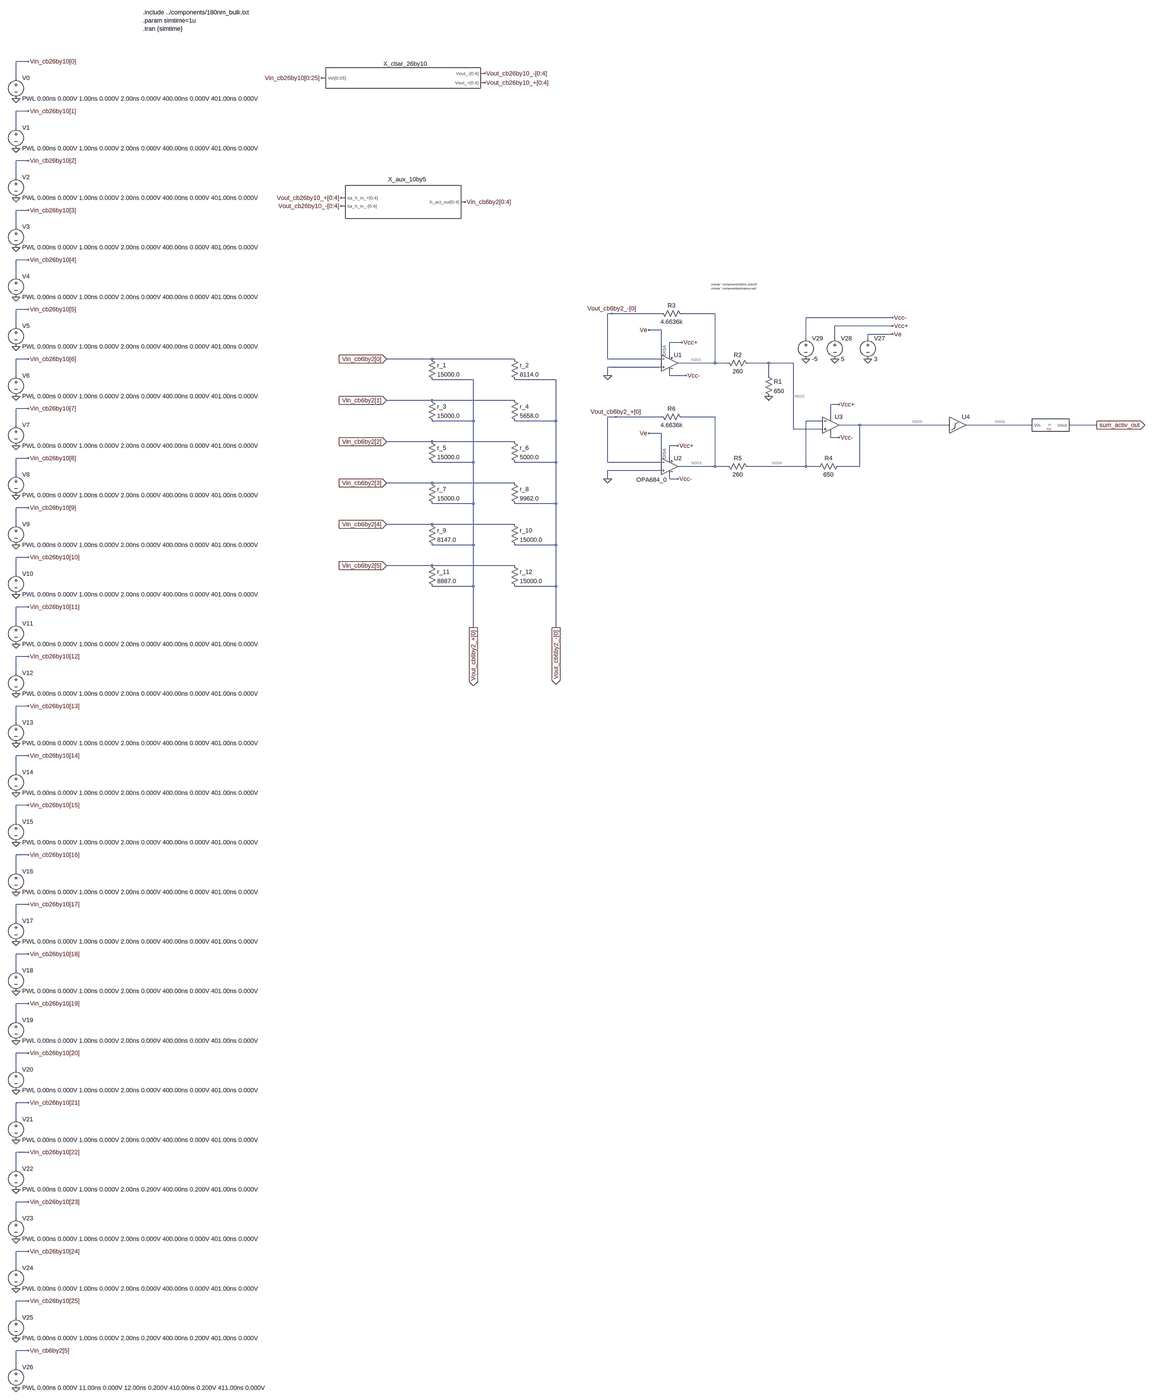
[diagram p0: schematic complete_circuit_generated_2.asc, whole sheet]
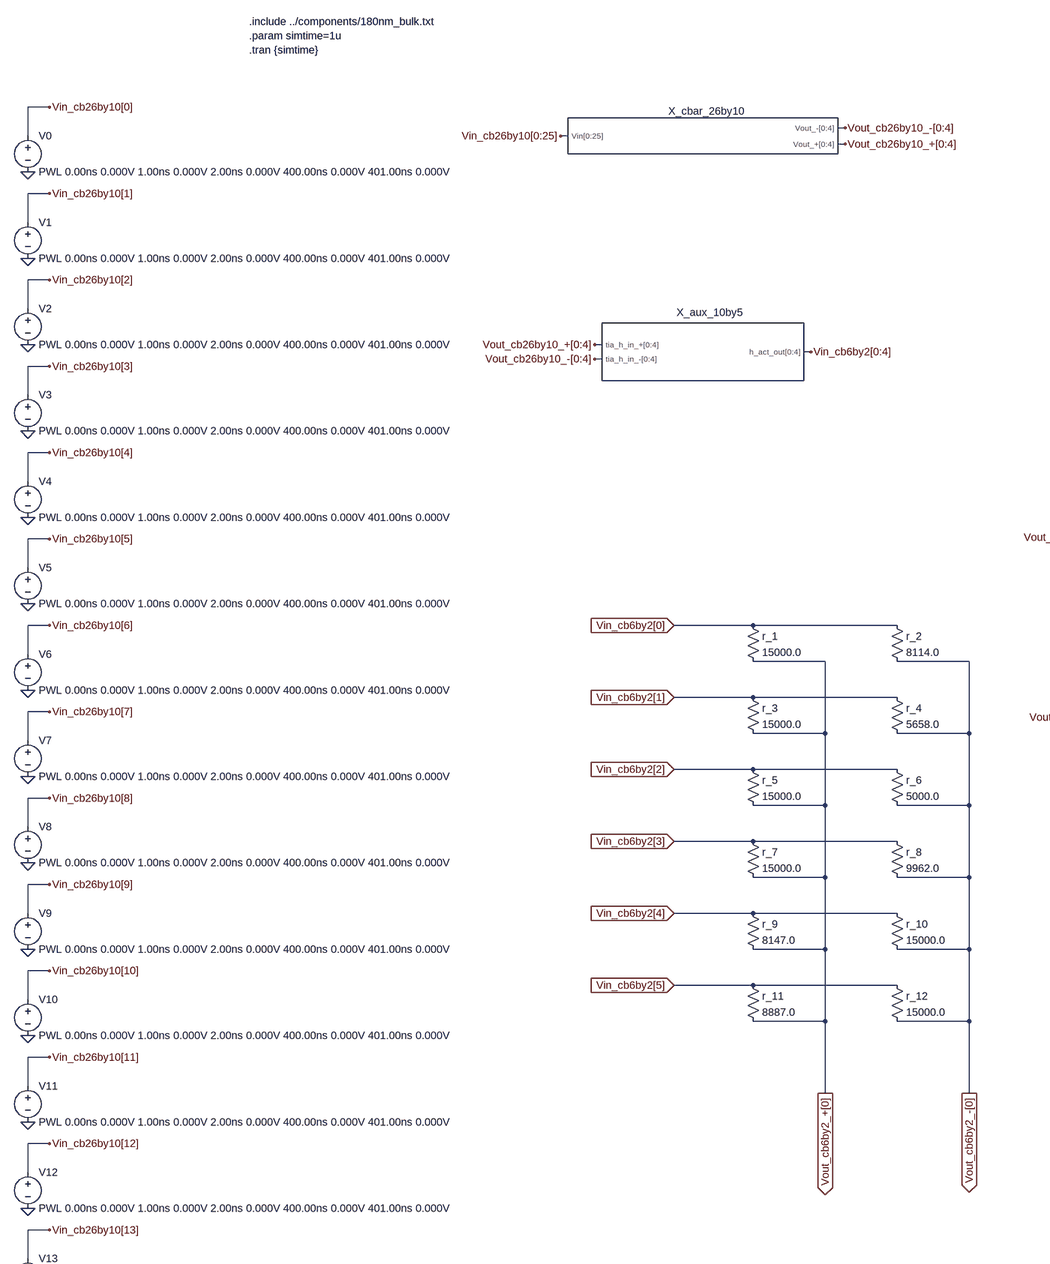
[diagram p1: schematic complete_circuit_generated_2.asc, part, row 1 of 2, column 1 of 2]
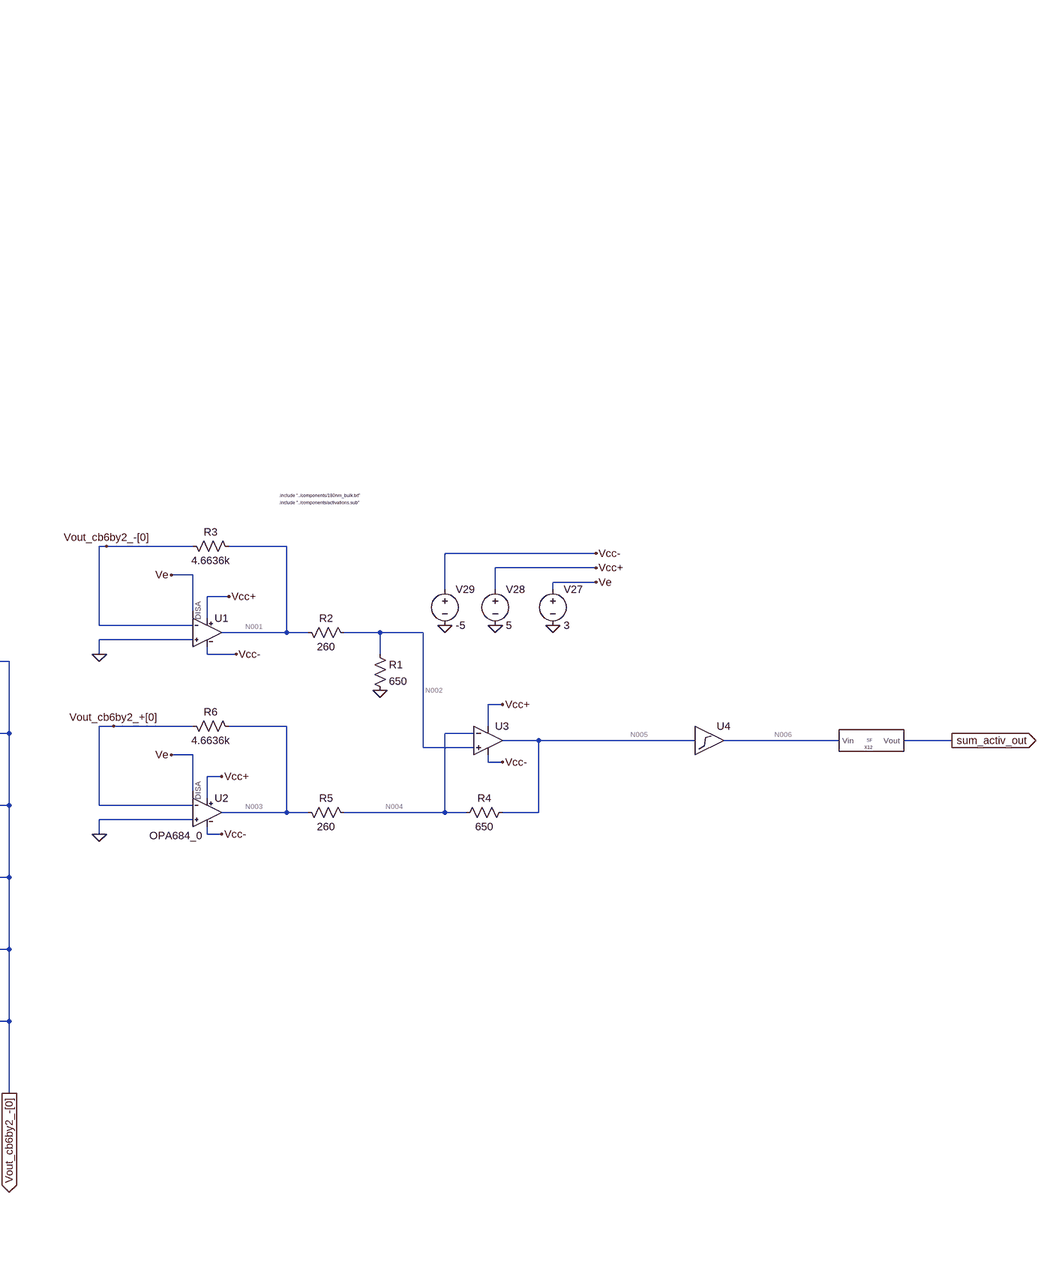
[diagram p2: schematic complete_circuit_generated_2.asc, part, row 1 of 2, column 2 of 2]
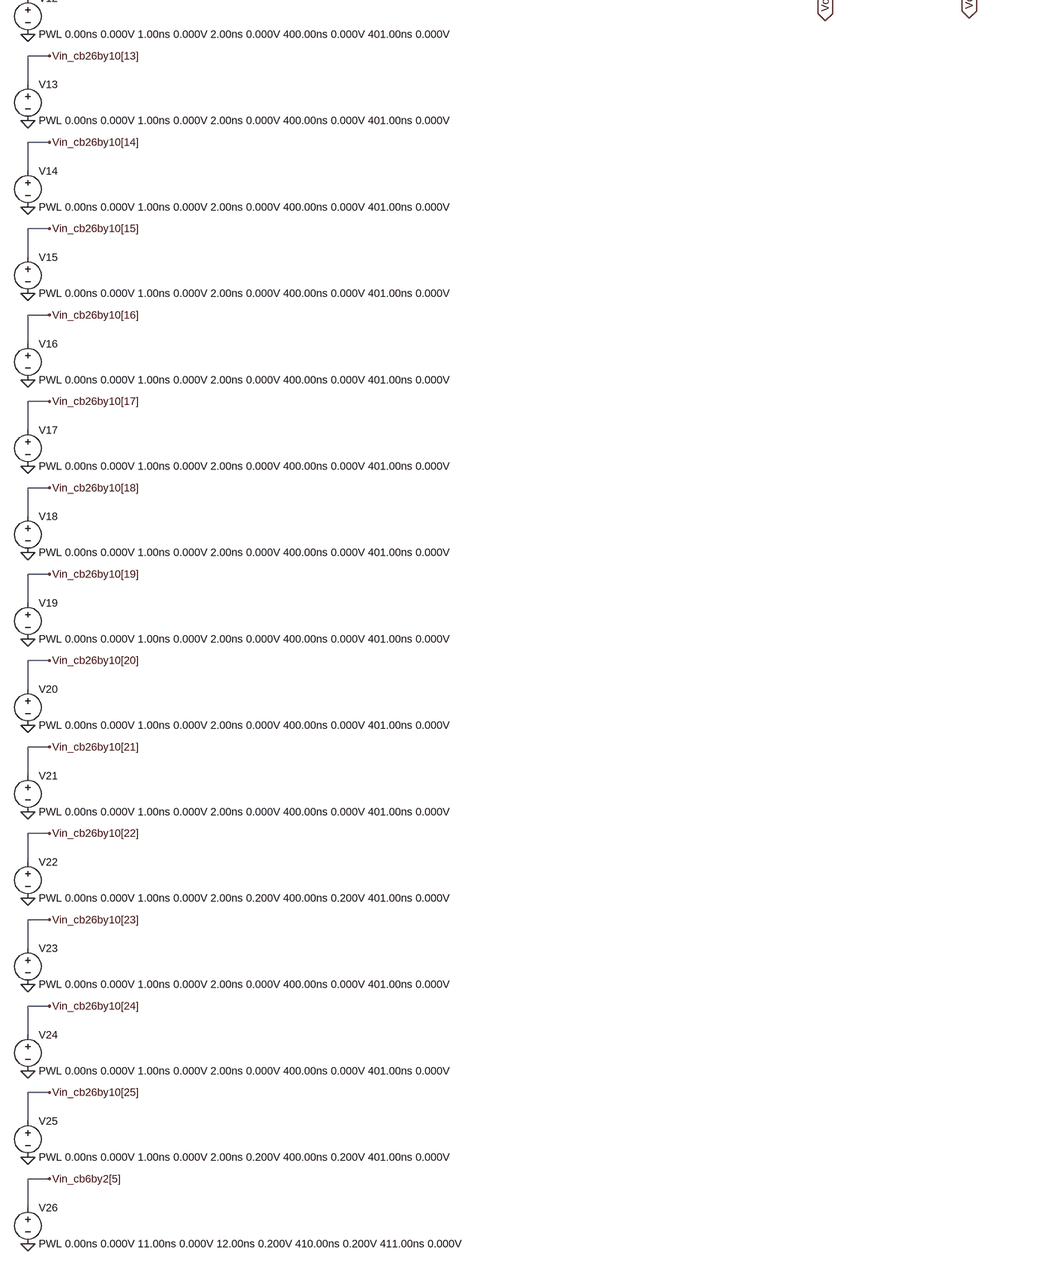
[diagram p3: schematic complete_circuit_generated_2.asc, part, row 2 of 2, column 1 of 2]
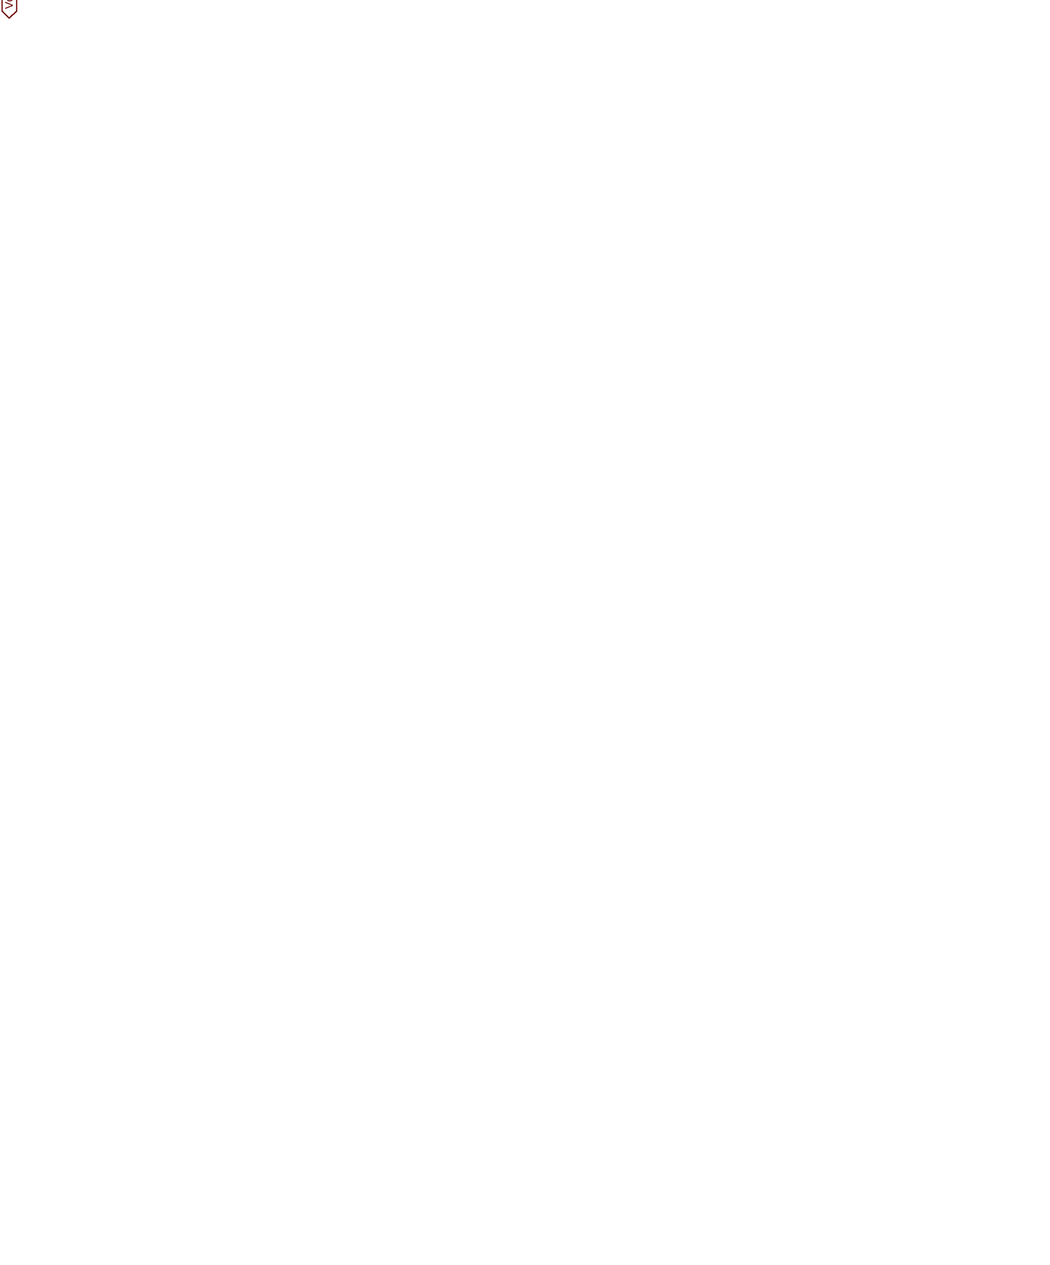
[diagram p4: schematic complete_circuit_generated_2.asc, part, row 2 of 2, column 2 of 2]
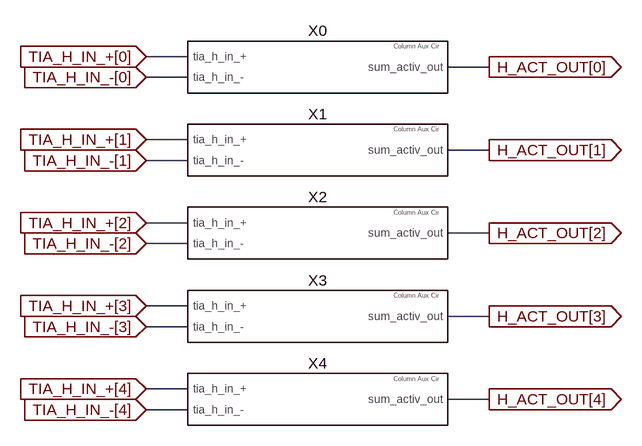
[diagram p5: sub-circuit x_aux_10by5.asc]
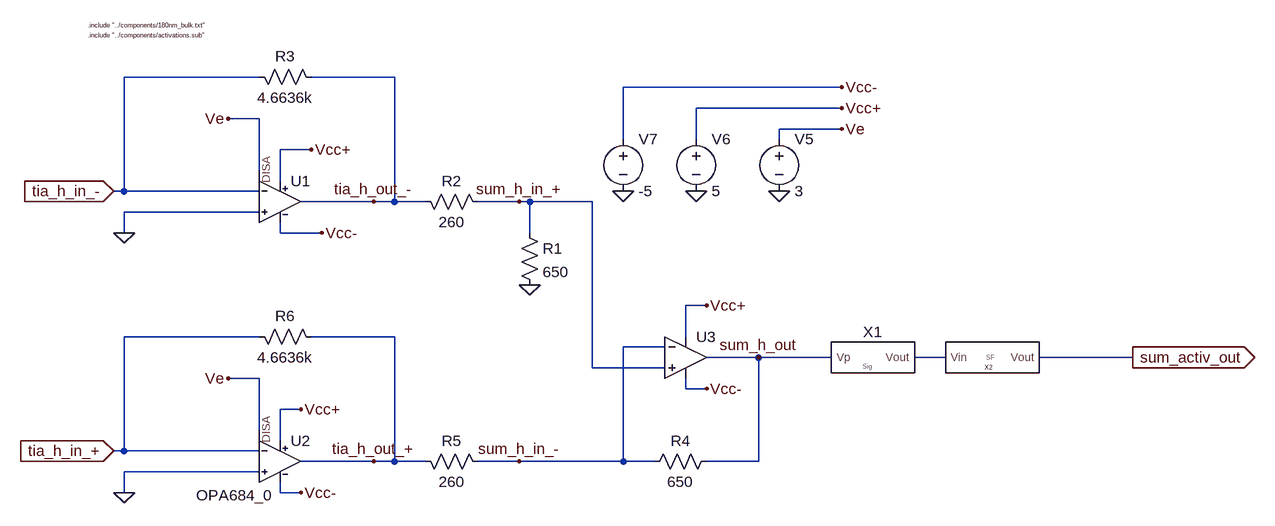
[diagram p6: sub-circuit column_activ_cmos.asc]
* complete_circuit_generated_2.asc
XX_cbar_26by10 Vin_cb26by10[0] Vin_cb26by10[1] Vin_cb26by10[2] Vin_cb26by10[3] Vin_cb26by10[4] Vin_cb26by10[5] Vin_cb26by10[6] Vin_cb26by10[7] Vin_cb26by10[8] Vin_cb26by10[9] Vin_cb26by10[10] Vin_cb26by10[11] Vin_cb26by10[12] Vin_cb26by10[13] Vin_cb26by10[14] Vin_cb26by10[15] Vin_cb26by10[16] Vin_cb26by10[17] Vin_cb26by10[18] Vin_cb26by10[19] Vin_cb26by10[20] Vin_cb26by10[21] Vin_cb26by10[22] Vin_cb26by10[23] Vin_cb26by10[24] Vin_cb26by10[25] Vout_cb26by10_+[0] Vout_cb26by10_+[1] Vout_cb26by10_+[2] Vout_cb26by10_+[3] Vout_cb26by10_+[4] Vout_cb26by10_-[0] Vout_cb26by10_-[1] Vout_cb26by10_-[2] Vout_cb26by10_-[3] Vout_cb26by10_-[4] X_cbar_26by10  ; pins Vin[0:25] Vout_+[0:4] Vout_-[0:4]
XX_aux_10by5 Vout_cb26by10_+[0] Vout_cb26by10_+[1] Vout_cb26by10_+[2] Vout_cb26by10_+[3] Vout_cb26by10_+[4] Vout_cb26by10_-[0] Vout_cb26by10_-[1] Vout_cb26by10_-[2] Vout_cb26by10_-[3] Vout_cb26by10_-[4] Vin_cb6by2[0] Vin_cb6by2[1] Vin_cb6by2[2] Vin_cb6by2[3] Vin_cb6by2[4] x_aux_10by5
V0 Vin_cb26by10[0] 0 PWL 0.00ns 0.000V 1.00ns 0.000V 2.00ns 0.000V 400.00ns 0.000V 401.00ns 0.000V
V1 Vin_cb26by10[1] 0 PWL 0.00ns 0.000V 1.00ns 0.000V 2.00ns 0.000V 400.00ns 0.000V 401.00ns 0.000V
V2 Vin_cb26by10[2] 0 PWL 0.00ns 0.000V 1.00ns 0.000V 2.00ns 0.000V 400.00ns 0.000V 401.00ns 0.000V
V3 Vin_cb26by10[3] 0 PWL 0.00ns 0.000V 1.00ns 0.000V 2.00ns 0.000V 400.00ns 0.000V 401.00ns 0.000V
V4 Vin_cb26by10[4] 0 PWL 0.00ns 0.000V 1.00ns 0.000V 2.00ns 0.000V 400.00ns 0.000V 401.00ns 0.000V
V5 Vin_cb26by10[5] 0 PWL 0.00ns 0.000V 1.00ns 0.000V 2.00ns 0.000V 400.00ns 0.000V 401.00ns 0.000V
V6 Vin_cb26by10[6] 0 PWL 0.00ns 0.000V 1.00ns 0.000V 2.00ns 0.000V 400.00ns 0.000V 401.00ns 0.000V
V7 Vin_cb26by10[7] 0 PWL 0.00ns 0.000V 1.00ns 0.000V 2.00ns 0.000V 400.00ns 0.000V 401.00ns 0.000V
V8 Vin_cb26by10[8] 0 PWL 0.00ns 0.000V 1.00ns 0.000V 2.00ns 0.000V 400.00ns 0.000V 401.00ns 0.000V
V9 Vin_cb26by10[9] 0 PWL 0.00ns 0.000V 1.00ns 0.000V 2.00ns 0.000V 400.00ns 0.000V 401.00ns 0.000V
V10 Vin_cb26by10[10] 0 PWL 0.00ns 0.000V 1.00ns 0.000V 2.00ns 0.000V 400.00ns 0.000V 401.00ns 0.000V
V11 Vin_cb26by10[11] 0 PWL 0.00ns 0.000V 1.00ns 0.000V 2.00ns 0.000V 400.00ns 0.000V 401.00ns 0.000V
V12 Vin_cb26by10[12] 0 PWL 0.00ns 0.000V 1.00ns 0.000V 2.00ns 0.000V 400.00ns 0.000V 401.00ns 0.000V
V13 Vin_cb26by10[13] 0 PWL 0.00ns 0.000V 1.00ns 0.000V 2.00ns 0.000V 400.00ns 0.000V 401.00ns 0.000V
V14 Vin_cb26by10[14] 0 PWL 0.00ns 0.000V 1.00ns 0.000V 2.00ns 0.000V 400.00ns 0.000V 401.00ns 0.000V
V15 Vin_cb26by10[15] 0 PWL 0.00ns 0.000V 1.00ns 0.000V 2.00ns 0.000V 400.00ns 0.000V 401.00ns 0.000V
V16 Vin_cb26by10[16] 0 PWL 0.00ns 0.000V 1.00ns 0.000V 2.00ns 0.000V 400.00ns 0.000V 401.00ns 0.000V
V17 Vin_cb26by10[17] 0 PWL 0.00ns 0.000V 1.00ns 0.000V 2.00ns 0.000V 400.00ns 0.000V 401.00ns 0.000V
V18 Vin_cb26by10[18] 0 PWL 0.00ns 0.000V 1.00ns 0.000V 2.00ns 0.000V 400.00ns 0.000V 401.00ns 0.000V
V19 Vin_cb26by10[19] 0 PWL 0.00ns 0.000V 1.00ns 0.000V 2.00ns 0.000V 400.00ns 0.000V 401.00ns 0.000V
V20 Vin_cb26by10[20] 0 PWL 0.00ns 0.000V 1.00ns 0.000V 2.00ns 0.000V 400.00ns 0.000V 401.00ns 0.000V
V21 Vin_cb26by10[21] 0 PWL 0.00ns 0.000V 1.00ns 0.000V 2.00ns 0.000V 400.00ns 0.000V 401.00ns 0.000V
V22 Vin_cb26by10[22] 0 PWL 0.00ns 0.000V 1.00ns 0.000V 2.00ns 0.200V 400.00ns 0.200V 401.00ns 0.000V
V23 Vin_cb26by10[23] 0 PWL 0.00ns 0.000V 1.00ns 0.000V 2.00ns 0.000V 400.00ns 0.000V 401.00ns 0.000V
V24 Vin_cb26by10[24] 0 PWL 0.00ns 0.000V 1.00ns 0.000V 2.00ns 0.000V 400.00ns 0.000V 401.00ns 0.000V
V25 Vin_cb26by10[25] 0 PWL 0.00ns 0.000V 1.00ns 0.000V 2.00ns 0.200V 400.00ns 0.200V 401.00ns 0.000V
V26 Vin_cb6by2[5] 0 PWL 0.00ns 0.000V 11.00ns 0.000V 12.00ns 0.200V 410.00ns 0.200V 411.00ns 0.000V
R1 N002 0 650
R2 N002 N001 260
R3 N001 Vout_cb6by2_-[0] 4.6636k
XU1 0 Vout_cb6by2_-[0] Vcc+ Vcc- N001 Ve OPA684_0  ; pins In+ In- V+ V- OUT DISA
V27 Ve 0 3
V28 Vcc+ 0 5
V29 Vcc- 0 -5
R4 N005 N004 650
R5 N004 N003 260
R6 N003 Vout_cb6by2_+[0] 4.6636k
XU2 0 Vout_cb6by2_+[0] Vcc+ Vcc- N003 Ve OPA684_0  ; pins In+ In- V+ V- OUT DISA
XU3 N002 N004 Vcc+ Vcc- N005 MAX4223  ; pins In+ In- V+ V- OUT
XX12 N006 sum_activ_out sourceFollower  ; pins Vin Vout
r_1 Vin_cb6by2[0] Vout_cb6by2_+[0] 15000.0
r_2 Vin_cb6by2[0] Vout_cb6by2_-[0] 8114.0
r_3 Vin_cb6by2[1] Vout_cb6by2_+[0] 15000.0
r_4 Vin_cb6by2[1] Vout_cb6by2_-[0] 5658.0
r_5 Vin_cb6by2[2] Vout_cb6by2_+[0] 15000.0
r_6 Vin_cb6by2[2] Vout_cb6by2_-[0] 5000.0
r_7 Vin_cb6by2[3] Vout_cb6by2_+[0] 15000.0
r_8 Vin_cb6by2[3] Vout_cb6by2_-[0] 9962.0
r_9 Vin_cb6by2[4] Vout_cb6by2_+[0] 8147.0
r_10 Vin_cb6by2[4] Vout_cb6by2_-[0] 15000.0
r_11 Vin_cb6by2[5] Vout_cb6by2_+[0] 8887.0
r_12 Vin_cb6by2[5] Vout_cb6by2_-[0] 15000.0
XU4 N005 N006 ReLU  ; pins In OUT

* block symbol definitions
.subckt x_aux_10by5 tia_h_in_+[0] tia_h_in_+[1] tia_h_in_+[2] tia_h_in_+[3] tia_h_in_+[4] tia_h_in_-[0] tia_h_in_-[1] tia_h_in_-[2] tia_h_in_-[3] tia_h_in_-[4] h_act_out[0] h_act_out[1] h_act_out[2] h_act_out[3] h_act_out[4]
XX0 TIA_H_IN_+[0] TIA_H_IN_-[0] H_ACT_OUT[0] column_activ_cmos
XX1 TIA_H_IN_+[1] TIA_H_IN_-[1] H_ACT_OUT[1] column_activ_cmos
XX2 TIA_H_IN_+[2] TIA_H_IN_-[2] H_ACT_OUT[2] column_activ_cmos
XX3 TIA_H_IN_+[3] TIA_H_IN_-[3] H_ACT_OUT[3] column_activ_cmos
XX4 TIA_H_IN_+[4] TIA_H_IN_-[4] H_ACT_OUT[4] column_activ_cmos
.ends x_aux_10by5

.subckt column_activ_cmos tia_h_in_+ tia_h_in_- sum_activ_out
R1 sum_h_in_+ 0 650
R2 sum_h_in_+ tia_h_out_- 260
R3 tia_h_out_- tia_h_in_- 4.6636k
XU1 0 tia_h_in_- Vcc+ Vcc- tia_h_out_- Ve OPA684_0  ; pins In+ In- V+ V- OUT DISA
V5 Ve 0 3
V6 Vcc+ 0 5
V7 Vcc- 0 -5
R4 sum_h_out sum_h_in_- 650
R5 sum_h_in_- tia_h_out_+ 260
R6 tia_h_out_+ tia_h_in_+ 4.6636k
XU2 0 tia_h_in_+ Vcc+ Vcc- tia_h_out_+ Ve OPA684_0  ; pins In+ In- V+ V- OUT DISA
XU3 sum_h_in_+ sum_h_in_- Vcc+ Vcc- sum_h_out MAX4223  ; pins In+ In- V+ V- OUT
XX1 sum_h_out N001 RNN_Sigmoid3_HA  ; pins Vp Vout
XX2 N001 sum_activ_out sourceFollower  ; pins Vin Vout
.include "../components/activations.sub"
.include "../components/180nm_bulk.txt"
.ends column_activ_cmos

.tran {simtime}
.param simtime=1u
.include ../components/180nm_bulk.txt
.include "../components/activations.sub"
.include "../components/180nm_bulk.txt"
.backanno
.end

* Results of the author's LTspice run, read from the files saved beside the schematic
* Operating Point, zero values left out:
*   V(vout_cb26by10_+[0]) = -426.9 µV
*   V(vout_cb26by10_-[0]) = -426.9 µV
*   V(vout_cb26by10_+[1]) = -426.9 µV
*   V(vout_cb26by10_-[1]) = -426.9 µV
*   V(vout_cb26by10_+[2]) = -426.9 µV
*   V(vout_cb26by10_-[2]) = -426.9 µV
*   V(vout_cb26by10_+[3]) = -426.9 µV
*   V(vout_cb26by10_-[3]) = -426.9 µV
*   V(vout_cb26by10_+[4]) = -426.9 µV
*   V(vout_cb26by10_-[4]) = -426.9 µV
*   V(vin_cb6by2[0]) = 3.035 mV
*   V(vin_cb6by2[1]) = 3.035 mV
*   V(vin_cb6by2[2]) = 3.035 mV
*   V(vin_cb6by2[3]) = 3.035 mV
*   V(vin_cb6by2[4]) = 3.256 mV
*   V(n002) = 4.047 mV
*   V(n001) = 6.576 mV
*   V(vout_cb6by2_-[0]) = -426.8 µV
*   V(ve) = 3 V
*   V(vcc-) = -5 V
*   V(vcc+) = 5 V
*   V(n005) = -15.3 mV
*   V(n004) = 4.037 mV
*   V(n003) = 10.86 mV
*   V(vout_cb6by2_+[0]) = -426.9 µV
*   V(sum_activ_out) = 3.035 mV
*   V(n006) = 3.035 mV
*   I(R1) = 6.226 µA
*   I(R2) = -9.726 µA
*   I(R3) = 1.502 µA
*   I(R4) = -29.75 µA
*   I(R5) = -26.25 µA
*   I(R6) = 2.421 µA
*   I(R_1) = 230.8 nA
*   I(R_2) = 426.6 nA
*   I(R_3) = 230.8 nA
*   I(R_4) = 611.9 nA
*   I(R_5) = 230.8 nA
*   I(R_6) = 692.4 nA
*   I(R_7) = 230.8 nA
*   I(R_8) = 347.5 nA
*   I(R_9) = 452.1 nA
*   I(R_10) = 245.5 nA
*   I(R_11) = 48.03 nA
*   I(R_12) = 28.46 nA
*   I(V0) = -329.3 nA
*   I(V1) = -345.9 nA
*   I(V2) = -345 nA
*   I(V3) = -334.6 nA
*   I(V4) = -338.9 nA
*   I(V5) = -334.7 nA
*   I(V6) = -345.7 nA
*   I(V7) = -337.1 nA
*   I(V8) = -342.1 nA
*   I(V9) = -341.2 nA
*   I(V10) = -349.9 nA
*   I(V11) = -337.5 nA
*   I(V12) = -336.6 nA
*   I(V13) = -339.9 nA
*   I(V14) = -351.8 nA
*   I(V15) = -343.4 nA
*   I(V16) = -344.5 nA
*   I(V17) = -345.3 nA
*   I(V18) = -347.5 nA
*   I(V19) = -334.7 nA
*   I(V20) = -350.1 nA
*   I(V21) = -343.5 nA
*   I(V22) = -341 nA
*   I(V23) = -341.6 nA
*   I(V24) = -334.1 nA
*   I(V25) = -414.5 nA
*   I(V26) = -76.49 nA
*   I(V27) = -5.606 nA
*   I(V28) = -6.381 mA
*   I(V29) = 4.764 mA
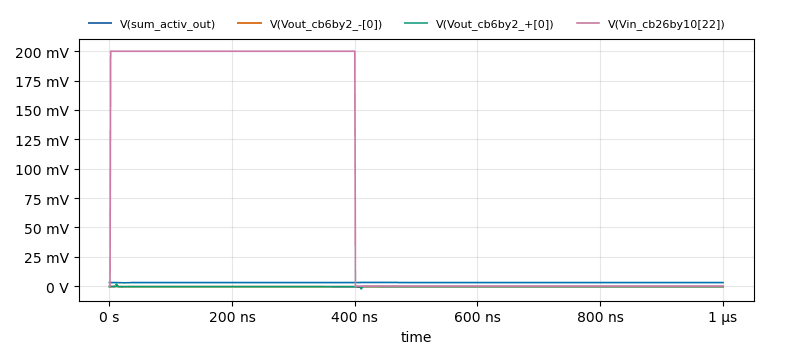
[diagram p7: Transient Analysis of complete_circuit_generated_2.asc, plotted from the saved traces]
* Transient Analysis, 1 run:
*   V(sum_activ_out): min 2.778 mV, max 3.176 mV, average 3.037 mV, rms 3.037 mV, last 3.035 mV
*   V(Vout_cb6by2_-[0]): min -1.668 mV, max 1.359 mV, average -425.2 µV, rms 432 µV, last -426.8 µV
*   V(Vout_cb6by2_+[0]): min -2.307 mV, max 1.633 mV, average -426 µV, rms 434.5 µV, last -426.9 µV
*   V(Vin_cb26by10[22]): min 0 V, max 200 mV, average 79.8 mV, rms 126.3 mV, last 0 V